# EAGLE schematic legatus (EAGLE 9.6.1)
CNAME: Parrot Teensy Board; CREVISION: 1.0; DESIGNER: Nathan Villicana-Shaw
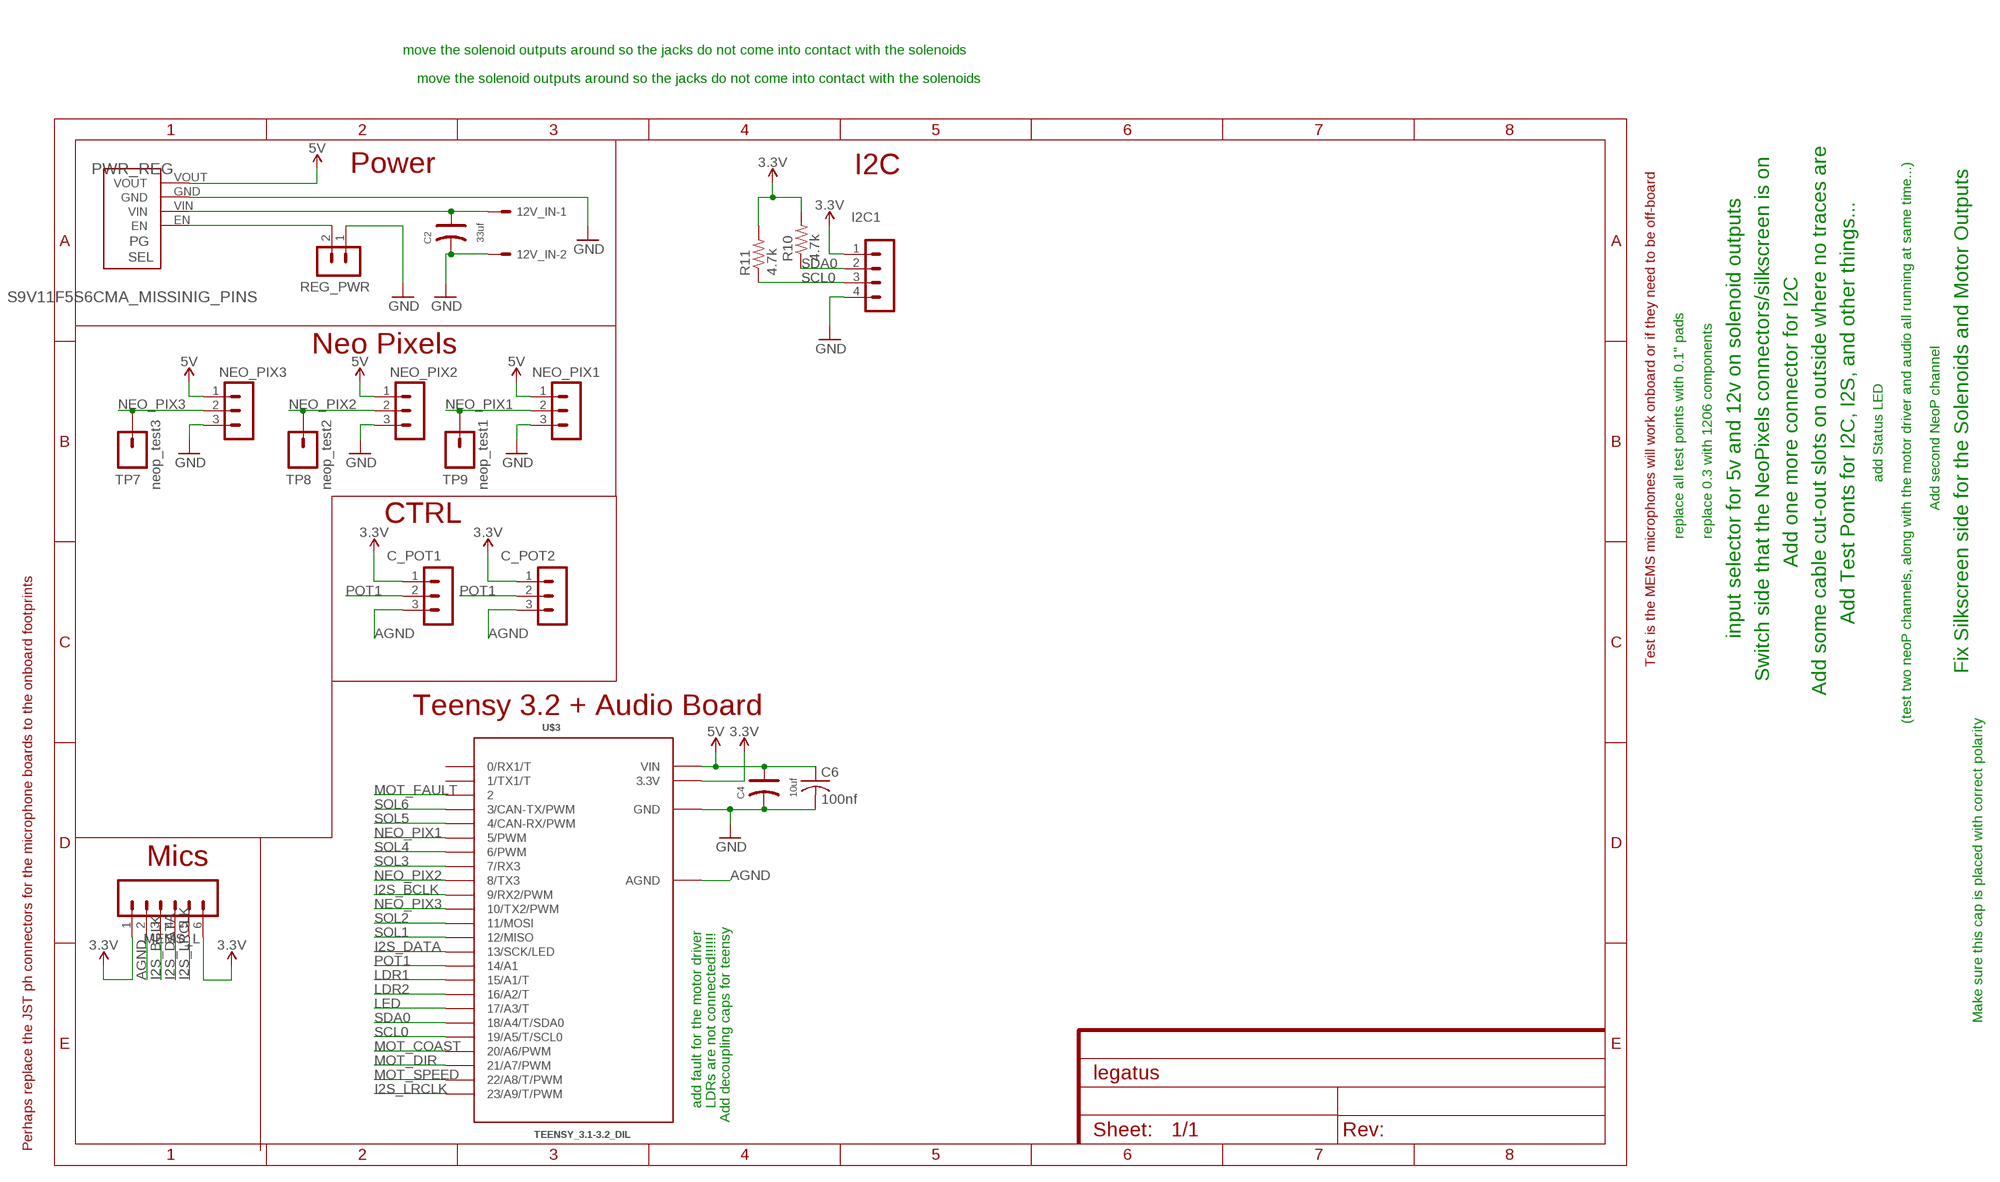
[diagram p0: schematic, sheet 1]

## Parts
12V_IN  5566-2  [5566-2]
C2  33uf  DIP-ALUMINUM-47UF-16V(D5-H7MM)  [PC-D5.3MM]
C4  10uf  DIP-ALUMINUM-47UF-16V(D5-H7MM)  [PC-D5.3MM]
C6  100nf  C-USC2012  [C2012]
C_POT1  B3B-PH-K  [B3B-PH-K]
C_POT2  B3B-PH-K  [B3B-PH-K]
I2C1  B4B-PH-K  [B4B-PH-K]
MEMS_L  CONN_06POLAR  [MOLEX-1X6]
NEO_PIX1  B3B-PH-K  [B3B-PH-K]
NEO_PIX2  B3B-PH-K  [B3B-PH-K]
NEO_PIX3  B3B-PH-K  [B3B-PH-K]
PWR_REG  S9V11F5S6CMA_MISSINIG_PINS  [S9V11F3S5CMA_MISSING_PINS]
R10  4.7k  R-US_M1206  [M1206]
R11  4.7k  R-US_M1206  [M1206]
REG_PWR  B2B-PH-K  [B2B-PH-K]
TP7  neop_test3  CONN_01  [1X01]
TP8  neop_test2  CONN_01  [1X01]
TP9  neop_test1  CONN_01  [1X01]
U$3  TEENSY_3.1-3.2_DIL  [TEENSY_3.0-3.2&LC_DIL]

## Nets
3.3V [3.3V]: C_POT1.1 C_POT2.1 I2C1.1 MEMS_L.1 MEMS_L.6 R10.2 R11.2 U$3.3.3V
5V: C4.+ C6.1 NEO_PIX1.1 NEO_PIX2.1 NEO_PIX3.1 PWR_REG.VOUT U$3.VIN
12V [12V_IN]: 12V_IN.1 C2.+ PWR_REG.VIN
AGND: C_POT1.3 C_POT2.3 MEMS_L.2 U$3.AGND
GND: 12V_IN.2 C2.- C4.- C6.2 I2C1.4 NEO_PIX1.3 NEO_PIX2.3 NEO_PIX3.3 PWR_REG.GND REG_PWR.1 U$3.GND
I2S_BCLK: MEMS_L.3 U$3.9(9/RX2/PWM)
I2S_DATA: MEMS_L.4 U$3.13(13/SCK/LED)
I2S_LRCLK: MEMS_L.5 U$3.23/A9(23/A9/T/PWM)
LDR1: U$3.15/A1(15/A1/T)
LDR2: U$3.16/A2(16/A2/T)
LED: U$3.17/A3(17/A3/T)
MOT_COAST: U$3.20/A6(20/A6/PWM)
MOT_DIR: U$3.21/A7(21/A7/PWM)
MOT_FAULT: U$3.2
MOT_SPEED: U$3.22/A8(22/A8/T/PWM)
N$10: PWR_REG.EN REG_PWR.2
NEO_PIX1: NEO_PIX1.2 TP9.1 U$3.5(5/PWM)
NEO_PIX2: NEO_PIX2.2 TP8.1 U$3.8(8/TX3)
NEO_PIX3: NEO_PIX3.2 TP7.1 U$3.10(10/TX2/PWM)
POT1: C_POT1.2 C_POT2.2 U$3.14/A0(14/A1)
SCL0: I2C1.3 R11.1 U$3.19/A5(19/A5/T/SCL0)
SDA0: I2C1.2 R10.1 U$3.18/A4(18/A4/T/SDA0)
SOL1: U$3.12(12/MISO)
SOL2: U$3.11(11/MOSI)
SOL3: U$3.7(7/RX3)
SOL4: U$3.6(6/PWM)
SOL5: U$3.4(4/CAN-RX/PWM)
SOL6: U$3.3(3/CAN-TX/PWM)
Unconnected: U$3.0(0/RX1/T) U$3.1(1/TX1/T)

## Notes on the sheet
- move the solenoid outputs around so the jacks do not come into contact with the solenoids
- move the solenoid outputs around so the jacks do not come into contact with the solenoids
- Power | Fix Silkscreen side for the Solenoids and Motor Outputs
- I2C
- Neo Pixels
- add Status LED
- Add second NeoP channel
- CTRL
- replace all test points with 0.1" pads | replace 0.3 with 1206 components
- Add one more connector for I2C
- Add Test Ponts for I2C, I2S, and other things...
- input selector for 5v and 12v on solenoid outputs
- Test is the MEMS microphones will work onboard or if they need to be off-board
- Switch side that the NeoPixels connectors/silkscreen is on
- Add some cable cut-out slots on outside where no traces are
- Teensy 3.2 + Audio Board
- (test two neoP channels, along with the motor driver and audio all running at same time...)
- Mics
- Make sure this cap is placed with correct polarity
- add fault for the motor driver | LDRs are not connected!!!!!!
- Add decoupling caps for teensy
- Perhaps replace the JST ph connectors for the microphone boards to the onboard footprints

## Library data of the parts
12V_IN = con-molex:5566-2: Mini FIT connector 2 pol Source: http://www.molex.com; MF: MOLEX; OC_FARNELL: 1822072; OC_NEWARK: unknown
C2 C4 = Seeed-Capacitor:DIP-ALUMINUM-47UF-16V(D5-H7MM): 302030033; MPN: KS 100uF/16V; VALUE: 100uf
C6 = adafruit:C-US: CAPACITOR, American symbol
C_POT1 C_POT2 NEO_PIX1-NEO_PIX3 = con-jst-ph:B3B-PH-K: HEADER
I2C1 = con-jst-ph:B4B-PH-K: HEADER
MEMS_L = SparkFun-Connectors:CONN_06: Multi connection point. Often used as Generic Header-pin footprint for 0.1 inch spaced/style header connections On any of the 0.1 inch spaced packages, you can populate with these: Break Away Headers - Straight <https://www.sparkfun.com/products/116> (PRT-00116) Break Away Male Headers - Right Angle <https://www.sparkfun.com/products/553> (PRT-00553) Female Headers <https://www.sparkfun.com/products/115> (PRT-00115) Break Away Headers - Machine Pin <https://www.sparkfun.com/products/117> (PRT-00117) Break Away Female Headers - Swiss Machine Pin <https://www.sparkfun.com/products/743> (PRT-00743) Arduino Stackable Header - 6 Pin <https://www.sparkfun.com/products/9280> (PRT-09280) For SCREWTERMINALS and SPRING TERMINALS visit here: Screw Terimnals on SparkFun.com <https://www.sparkfun.com/search/results?term=Screw+Terminals> (5mm/3.5mm/2.54mm spacing) This device is also useful as a general connection point to wire up your design to another part of your project. Our various solder wires solder well into these plated through hole pads. Hook-Up Wire - Assortment (Stranded, 22 AWG) <https://www.sparkfun.com/products/11375> (PRT-11375) Hook-Up Wire - Assortment (Solid Core, 22 AWG) <https://www.sparkfun.com/products/11367> (PRT-11367) View the entire wire category on our website here <https://www.sparkfun.com/categories/141>
PWR_REG = nathans-custom-parts:S9V11F5S6CMA_MISSINIG_PINS
R10 R11 = adafruit:R-US_: RESISTOR, American symbol
REG_PWR = con-jst-ph:B2B-PH-K: HEADER
TP7-TP9 = SparkFun-Connectors:CONN_01: Single connection point. Often used as Generic Header-pin footprint for 0.1 inch spaced/style header connections On any of the 0.1 inch spaced packages, you can populate with these: Break Away Headers - Straight <https://www.sparkfun.com/products/116> (PRT-00116) Break Away Male Headers - Right Angle <https://www.sparkfun.com/products/553> (PRT-00553) Female Headers <https://www.sparkfun.com/products/115> (PRT-00115) Break Away Headers - Machine Pin <https://www.sparkfun.com/products/117> (PRT-00117) Break Away Female Headers - Swiss Machine Pin <https://www.sparkfun.com/products/743> (PRT-00743) This device is also useful as a general connection point to wire up your design to another part of your project. Our various solder wires solder well into these plated through hole pads. Hook-Up Wire - Assortment (Stranded, 22 AWG) <https://www.sparkfun.com/products/11375> (PRT-11375) Hook-Up Wire - Assortment (Solid Core, 22 AWG) <https://www.sparkfun.com/products/11367> (PRT-11367) View the entire wire category on our website here <https://www.sparkfun.com/categories/141> Special notes: SMTSO-256-ET is a "flush mount" nut for a 4-40 screw. We mostly use this on specialty testbeds; it is a nice way to connect hardware to your PCB at an adjustable hieght. Also note, the SNAP packages are for using a snappable style connector. We sell a baggie of snaps and they are also used on two LilyPad designs: Snap Assortment - 30 pack (male and female) <https://www.sparkfun.com/products/11347> (DEV-11347) LilyPad Arduino SimpleSnap <https://www.sparkfun.com/products/10941> (DEV-10941) LilyPad SimpleSnap Protoboard <https://www.sparkfun.com/products/10940> (DEV-10940)
U$3 = teensy_3_and_LC:TEENSY_3.1-3.2_DIL: Teensy 3.1 or 3.2 in a DIL Layout.

## Net classes
0 default: width 0.203 mm, drill 0.254 mm, clearance 0.203 mm
1 12V_IN: width 1.016 mm, drill 0.762 mm, clearance 0.305 mm
2 3.3V: width 0.305 mm, drill 0.508 mm, clearance 0.254 mm
3 5V: width 0.787 mm, drill 0.508 mm, clearance 0.381 mm